# EAGLE board zx80 SD_12 (smd) build006 (STM32) (EAGLE 9.6.2), part 1 of 2
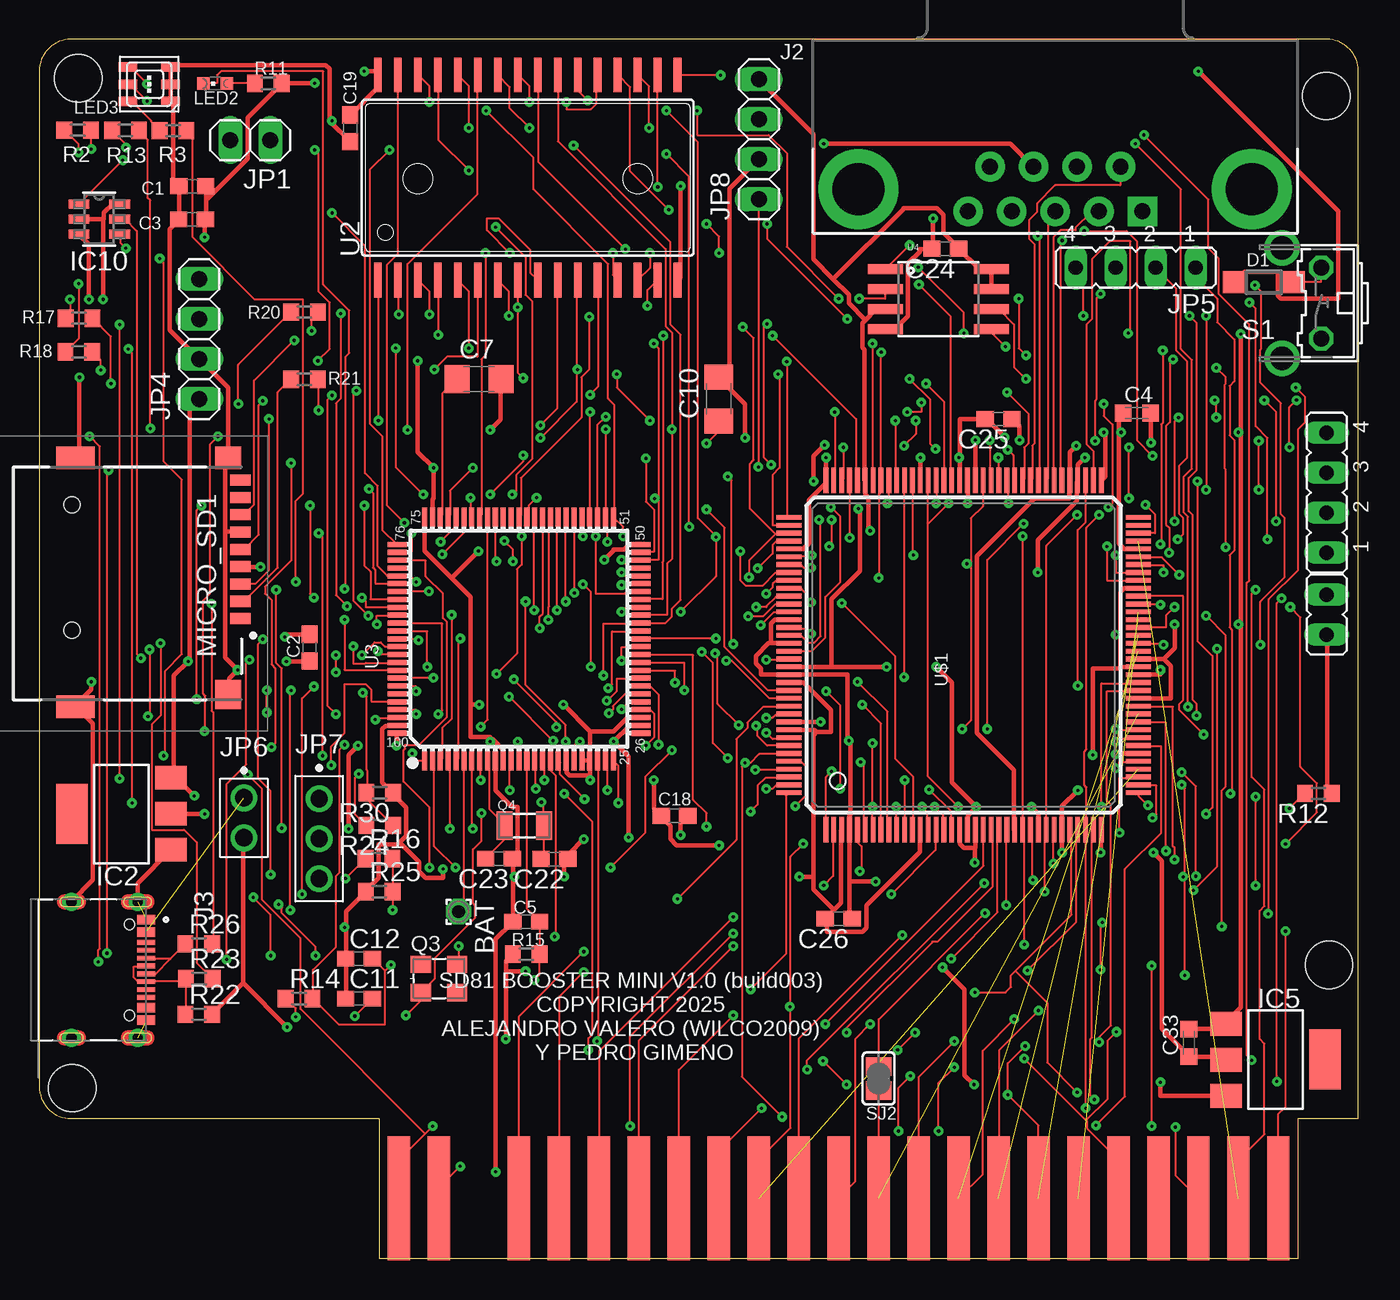
[diagram p3: board, top side]
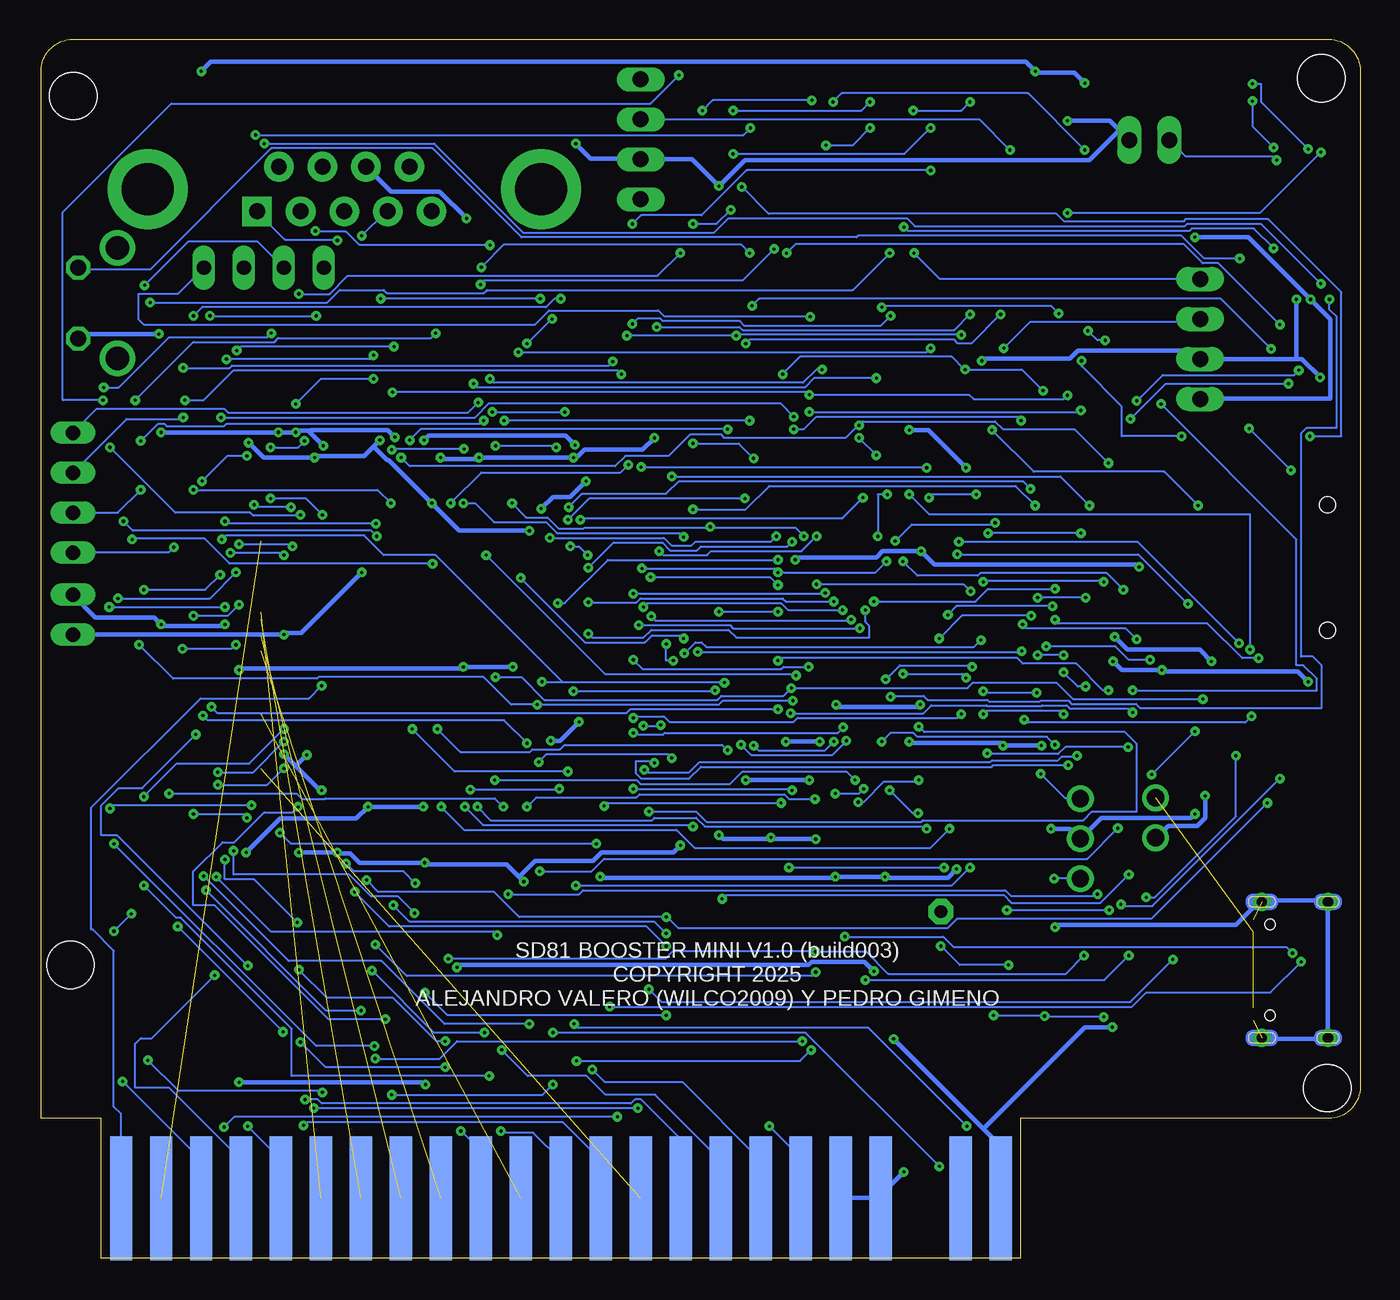
[diagram p4: board, bottom side, seen from below]

Size 83.82 x 77.47 mm. Coordinates in mm from the lower left corner, seen from the top.
Outline: 2,8.89 21.59,8.89 21.59,0 80.01,0 80.01,8.89 83.82,8.89 83.82,75.47 arc90 81.82,77.47 2,77.47 arc90 0,75.47 0,10.89 arc90 2,8.89
Copper layers (1*16): Top 0.035mm / dielectric 1.5mm / Bottom 0.035mm
Design rules "default *": minimum track width 5mil, minimum drill 0.2mm, track to track 6mil, track to pad 6mil, pad to pad 6mil, via to via 6mil, smd to smd 6mil, copper to edge 40mil, drill to drill 6mil, minimum pad ring 10mil, minimum via ring 8mil, stop-mask expansion 4mil, vias tented up to drill 999mil, thermal gap 10mil
Net classes: 1 VCC: width 0.3 mm; 2 3,3: width 0.3 mm
Holes 3 mm at 2.09,10.82 2.46,74.99 81.79,73.87 81.96,18.64

## Footprints (pad centres in the part's own frame; a part is rotated, then mirrored left to right if it is on the bottom)
EDGEPIN = smd 1.422 x 7.874: 1 0,0
1,6/0,8 = drill 0.813 pad 1.6 octagon: 1 0,0
C0603 = smd 1.1 x 1: 1 -0.85,0; 2 0.85,0
C0603K = smd 1.05 x 1.08: 1 -0.875,0; 2 0.875,0
C1206 = smd 1.6 x 1.8: 1 -1.4,0; 2 1.4,0
SOD123 = smd 1.4 x 1.4: A 1.9,0; C -1.9,0
SOT223 = smd 1.499 x 2.007: 1 -2.261,-3.15; 2 0.025,-3.15; 3 2.311,-3.15 | smd 3.81 x 2.007: 4 0,3.15
SOT-23-6_MC = smd 1.321 x 0.559: 1 -1.295,0.95; 2 -1.295,0; 3 -1.295,-0.95; 4 1.295,-0.95; 5 1.295,0; 6 1.295,0.95
DB9_MALE = drill 1.016 pad 1.88 square: 1 5.54,-1.42 | drill 1.016 pad 1.88: 2 2.77,-1.42; 3 0,-1.42; 4 -2.77,-1.42; 5 -5.54,-1.42; 6 4.15,1.42; 7 1.38,1.42; 8 -1.38,1.42; 9 -4.15,1.42 | drill 3.302 pad 5.08: G1 -12.5,0; G2 12.5,0
SHOUHAN_TYPE-C_16PIN_2MD__073_ = smd 0.6 x 1.14: A1_B12 -3.2,3.675; A4_B9 -2.4,3.675; B1_A12 3.2,3.675; B4_A9 2.4,3.675 | smd 0.3 x 1.14: A5 -1.25,3.675; A6 -0.25,3.675; A7 0.25,3.675; A8 1.25,3.675; B5 1.75,3.675; B6 0.75,3.675; B7 -0.75,3.675; B8 -1.75,3.675 | drill 0.65 pad 0.95: SH1 -4.325,3.125; SH2 4.325,3.125; SH3 -4.325,-1.075; SH4 4.325,-1.075 | hole 0.65: -2.89,2.605; 2.89,2.605
1X02 = drill 1.016 long: 1 -1.27,0; 2 1.27,0
JP1 = drill 0.914 long: 1 0,-1.27; 2 0,1.27
JP4 = drill 0.914 long: 1 -3.81,0; 2 -1.27,0; 3 1.27,0; 4 3.81,0
1X04 = drill 1.016 long: 1 -3.81,0; 2 -1.27,0; 3 1.27,0; 4 3.81,0
HDRV2W64P254_2X1_300X350X838B = drill 1.105 pad 1.705: 1 0,0; 2 0,-2.54
HDRV3W64P254_3X1_300X654X838B = drill 1.105 pad 1.705: 1 0,0; 2 0,-2.54; 3 0,-5.08
CHIPLED_0603 = smd 0.8 x 0.8: A 0,-0.75; C 0,0.75
3535-PLCC6 = smd 1.2 x 0.6: P1 1.35,-1.1; P2 1.35,0; P3 1.35,1.1; P4 -1.35,1.1; P5 -1.35,0; P6 -1.35,-1.1
TF-01A = smd 0.7 x 1.3: 1 2.23,7.174; 2 1.13,7.174; 3 0.03,7.174; 4 -1.07,7.174; 5 -2.17,7.174; 6 -3.27,7.174; 7 -4.37,7.174; 8 -5.47,7.174; CD1 -6.57,7.174 | smd 1.448 x 1.651: MP1 -7.989,6.4 | smd 1.448 x 2.438: MP2 -7.989,-3.3; MP3 7.836,-3.3 | smd 1.854 x 1.651: MP4 7.061,6.4 | hole 1: -5.004,-3.531; 2.972,-3.531
3.2X2.5_KX-7 = smd 1.3 x 1.1: 1 -1.15,-0.9; 2 1.15,-0.9; 3 1.15,0.9; 4 -1.15,0.9
3.2X1.5 = smd 1 x 1.8: 1 -1.25,0; 2 1.25,0
R0603 = smd 1 x 1.1: 1 -0.85,0; 2 0.85,0
B3F-31XX = drill 1.016 octagon: 1 -2.261,-1.245; 2 2.261,-1.245 | drill 1.499 pad 2.159: 3 -3.505,1.245; 4 3.505,1.245
SJ = smd 1.168 x 1.6: 1 -0.762,0; 2 0.762,0
SOP32-5 = smd 2.2 x 0.5: 1 -6.516,9.525; 2 -6.516,8.255; 3 -6.516,6.985; 4 -6.516,5.715; 5 -6.516,4.445; 6 -6.516,3.175; 7 -6.516,1.905; 8 -6.516,0.635; 9 -6.516,-0.635; 10 -6.516,-1.905; 11 -6.516,-3.175; 12 -6.516,-4.445; 13 -6.516,-5.715; 14 -6.516,-6.985; 15 -6.516,-8.255; 16 -6.516,-9.525; 17 6.516,-9.525; 18 6.516,-8.255; 19 6.516,-6.985; 20 6.516,-5.715; 21 6.516,-4.445; 22 6.516,-3.175; 23 6.516,-1.905; 24 6.516,-0.635; 25 6.516,0.635; 26 6.516,1.905; 27 6.516,3.175; 28 6.516,4.445; 29 6.516,5.715; 30 6.516,6.985; 31 6.516,8.255; 32 6.516,9.525
LQFP100-0.5-13.8X13.8MM = smd 1.2 x 0.32: 1 -7.75,6; 2 -7.75,5.5; 3 -7.75,5; 4 -7.75,4.5; 5 -7.75,4; 6 -7.75,3.5; 7 -7.75,3; 8 -7.75,2.5; 9 -7.75,2; 10 -7.75,1.5; 11 -7.75,1; 12 -7.75,0.5; 13 -7.75,0; 14 -7.75,-0.5; 15 -7.75,-1; 16 -7.75,-1.5; 17 -7.75,-2; 18 -7.75,-2.5; 19 -7.75,-3; 20 -7.75,-3.5; 21 -7.75,-4; 22 -7.75,-4.5; 23 -7.75,-5; 24 -7.75,-5.5; 25 -7.75,-6; 51 7.75,-6; 52 7.75,-5.5; 53 7.75,-5; 54 7.75,-4.5; 55 7.75,-4; 56 7.75,-3.5; 57 7.75,-3; 58 7.75,-2.5; 59 7.75,-2; 60 7.75,-1.5; 61 7.75,-1; 62 7.75,-0.5; 63 7.75,0; 64 7.75,0.5; 65 7.75,1; 66 7.75,1.5; 67 7.75,2; 68 7.75,2.5; 69 7.75,3; 70 7.75,3.5; 71 7.75,4; 72 7.75,4.5; 73 7.75,5; 74 7.75,5.5; 75 7.75,6 | smd 0.32 x 1.2: 26 -6,-7.75; 27 -5.5,-7.75; 28 -5,-7.75; 29 -4.5,-7.75; 30 -4,-7.75; 31 -3.5,-7.75; 32 -3,-7.75; 33 -2.5,-7.75; 34 -2,-7.75; 35 -1.5,-7.75; 36 -1,-7.75; 37 -0.5,-7.75; 38 0,-7.75; 39 0.5,-7.75; 40 1,-7.75; 41 1.5,-7.75; 42 2,-7.75; 43 2.5,-7.75; 44 3,-7.75; 45 3.5,-7.75; 46 4,-7.75; 47 4.5,-7.75; 48 5,-7.75; 49 5.5,-7.75; 50 6,-7.75; 76 6,7.75; 77 5.5,7.75; 78 5,7.75; 79 4.5,7.75; 80 4,7.75; 81 3.5,7.75; 82 3,7.75; 83 2.5,7.75; 84 2,7.75; 85 1.5,7.75; 86 1,7.75; 87 0.5,7.75; 88 0,7.75; 89 -0.5,7.75; 90 -1,7.75; 91 -1.5,7.75; 92 -2,7.75; 93 -2.5,7.75; 94 -3,7.75; 95 -3.5,7.75; 96 -4,7.75; 97 -4.5,7.75; 98 -5,7.75; 99 -5.5,7.75; 100 -6,7.75
SO08-EIAJ = smd 0.61 x 2.21: 1 -1.905,-3.378; 2 -0.635,-3.378; 3 0.635,-3.378; 4 1.905,-3.378; 5 1.905,3.353; 6 0.635,3.353; 7 -0.635,3.353; 8 -1.905,3.353
TQ144 = smd 1.6 x 0.3: P1 -11.1,8.75; P2 -11.1,8.25; P3 -11.1,7.75; P4 -11.1,7.25; P5 -11.1,6.75; P6 -11.1,6.25; P7 -11.1,5.75; P8 -11.1,5.25; P9 -11.1,4.75; P10 -11.1,4.25; P11 -11.1,3.75; P12 -11.1,3.25; P13 -11.1,2.75; P14 -11.1,2.25; P15 -11.1,1.75; P16 -11.1,1.25; P17 -11.1,0.75; P18 -11.1,0.25; P19 -11.1,-0.25; P20 -11.1,-0.75; P21 -11.1,-1.25; P22 -11.1,-1.75; P23 -11.1,-2.25; P24 -11.1,-2.75; P25 -11.1,-3.25; P26 -11.1,-3.75; P27 -11.1,-4.25; P28 -11.1,-4.75; P29 -11.1,-5.25; P30 -11.1,-5.75; P31 -11.1,-6.25; P32 -11.1,-6.75; P33 -11.1,-7.25; P34 -11.1,-7.75; P35 -11.1,-8.25; P36 -11.1,-8.75; P73 11.1,-8.75; P74 11.1,-8.25; P75 11.1,-7.75; P76 11.1,-7.25; P77 11.1,-6.75; P78 11.1,-6.25; P79 11.1,-5.75; P80 11.1,-5.25; P81 11.1,-4.75; P82 11.1,-4.25; P83 11.1,-3.75; P84 11.1,-3.25; P85 11.1,-2.75; P86 11.1,-2.25; P87 11.1,-1.75; P88 11.1,-1.25; P89 11.1,-0.75; P90 11.1,-0.25; P91 11.1,0.25; P92 11.1,0.75; P93 11.1,1.25; P94 11.1,1.75; P95 11.1,2.25; P96 11.1,2.75; P97 11.1,3.25; P98 11.1,3.75; P99 11.1,4.25; P100 11.1,4.75; P101 11.1,5.25; P102 11.1,5.75; P103 11.1,6.25; P104 11.1,6.75; P105 11.1,7.25; P106 11.1,7.75; P107 11.1,8.25; P108 11.1,8.75 | smd 0.3 x 1.6: P37 -8.75,-11.1; P38 -8.25,-11.1; P39 -7.75,-11.1; P40 -7.25,-11.1; P41 -6.75,-11.1; P42 -6.25,-11.1; P43 -5.75,-11.1; P44 -5.25,-11.1; P45 -4.75,-11.1; P46 -4.25,-11.1; P47 -3.75,-11.1; P48 -3.25,-11.1; P49 -2.75,-11.1; P50 -2.25,-11.1; P51 -1.75,-11.1; P52 -1.25,-11.1; P53 -0.75,-11.1; P54 -0.25,-11.1; P55 0.25,-11.1; P56 0.75,-11.1; P57 1.25,-11.1; P58 1.75,-11.1; P59 2.25,-11.1; P60 2.75,-11.1; P61 3.25,-11.1; P62 3.75,-11.1; P63 4.25,-11.1; P64 4.75,-11.1; P65 5.25,-11.1; P66 5.75,-11.1; P67 6.25,-11.1; P68 6.75,-11.1; P69 7.25,-11.1; P70 7.75,-11.1; P71 8.25,-11.1; P72 8.75,-11.1; P109 8.75,11.1; P110 8.25,11.1; P111 7.75,11.1; P112 7.25,11.1; P113 6.75,11.1; P114 6.25,11.1; P115 5.75,11.1; P116 5.25,11.1; P117 4.75,11.1; P118 4.25,11.1; P119 3.75,11.1; P120 3.25,11.1; P121 2.75,11.1; P122 2.25,11.1; P123 1.75,11.1; P124 1.25,11.1; P125 0.75,11.1; P126 0.25,11.1; P127 -0.25,11.1; P128 -0.75,11.1; P129 -1.25,11.1; P130 -1.75,11.1; P131 -2.25,11.1; P132 -2.75,11.1; P133 -3.25,11.1; P134 -3.75,11.1; P135 -4.25,11.1; P136 -4.75,11.1; P137 -5.25,11.1; P138 -5.75,11.1; P139 -6.25,11.1; P140 -6.75,11.1; P141 -7.25,11.1; P142 -7.75,11.1; P143 -8.25,11.1; P144 -8.75,11.1

## Placement (x,y rotation side)
1A  D7  [EDGEPIN]  22.86,3.81 0 top
1B  VCC  [EDGEPIN]  22.86,3.81 180 bottom
2A  /RAMCS  [EDGEPIN]  25.4,3.81 0 top
2B  9V  [EDGEPIN]  25.4,3.81 180 bottom
4A  D0  [EDGEPIN]  30.48,3.81 0 top
4B  GND  [EDGEPIN]  30.48,3.81 180 bottom
5A  D1  [EDGEPIN]  33.02,3.81 0 top
5B  GND  [EDGEPIN]  33.02,3.81 180 bottom
6A  D2  [EDGEPIN]  35.56,3.81 0 top
6B  /CLOCK  [EDGEPIN]  35.56,3.81 180 bottom
7A  D6  [EDGEPIN]  38.1,3.81 0 top
7B  A0  [EDGEPIN]  38.1,3.81 180 bottom
8A  D5  [EDGEPIN]  40.64,3.81 0 top
8B  A1  [EDGEPIN]  40.64,3.81 180 bottom
9A  D3  [EDGEPIN]  43.18,3.81 0 top
9B  A2  [EDGEPIN]  43.18,3.81 180 bottom
10A  D4  [EDGEPIN]  45.72,3.81 0 top
10B  A3  [EDGEPIN]  45.72,3.81 180 bottom
11A  A6  [EDGEPIN]  48.26,3.81 0 top
11B  A15  [EDGEPIN]  48.26,3.81 180 bottom
12A  /NMI  [EDGEPIN]  50.8,3.81 0 top
12B  A14  [EDGEPIN]  50.8,3.81 180 bottom
13A  /HALT  [EDGEPIN]  53.34,3.81 0 top
13B  A13  [EDGEPIN]  53.34,3.81 180 bottom
14A  /MREQ  [EDGEPIN]  55.88,3.81 0 top
14B  A12  [EDGEPIN]  55.88,3.81 180 bottom
15A  /IORQ  [EDGEPIN]  58.42,3.81 0 top
15B  A11  [EDGEPIN]  58.42,3.81 180 bottom
16A  /RD  [EDGEPIN]  60.96,3.81 0 top
16B  A10  [EDGEPIN]  60.96,3.81 180 bottom
17A  /WR  [EDGEPIN]  63.5,3.81 0 top
17B  A9  [EDGEPIN]  63.5,3.81 180 bottom
18A  /BUSAK  [EDGEPIN]  66.04,3.81 0 top
18B  A8  [EDGEPIN]  66.04,3.81 180 bottom
19A  /WAIT  [EDGEPIN]  68.58,3.81 0 top
19B  A7  [EDGEPIN]  68.58,3.81 180 bottom
20A  /BUSRQ  [EDGEPIN]  71.12,3.81 0 top
20B  A6  [EDGEPIN]  71.12,3.81 180 bottom
21A  /RESET  [EDGEPIN]  73.66,3.81 0 top
21B  A5  [EDGEPIN]  73.66,3.81 180 bottom
22A  /M1  [EDGEPIN]  76.2,3.81 0 top
22B  A4  [EDGEPIN]  76.2,3.81 180 bottom
23A  /RFSH  [EDGEPIN]  78.74,3.81 0 top
23B  /ROMCS  [EDGEPIN]  78.74,3.81 180 bottom
BAT  [1,6/0,8]  26.64,22.03 270 top
C1  100nF  [C0603]  9.72,68.13 180 top
C2  100nF  [C0603]  17.17,38.81 270 top
C3  100nF  [C0603]  9.71,66.02 180 top
C4  100nF  [C0603K]  69.75,53.73 0 top
C5  22pF  [C0603]  30.94,21.39 0 top
C7  10uF  [C1206]  27.94,55.88 0 top
C10  10uF  [C1206]  43.18,54.61 90 top
C11  22pF  [C0603]  20.32,16.51 0 top
C12  22pF  [C0603]  20.32,19.05 0 top
C18  100nF  [C0603]  40.37,28.11 0 top
C19  100nF  [C0603]  19.75,71.81 270 top
C22  22pF  [C0603]  32.73,25.38 180 top
C23  22pF  [C0603]  29.21,25.4 180 top
C24  0.1uF  [C0603]  57.58,64.17 180 top
C25  0.1uF  [C0603]  60.96,53.34 180 top
C26  100nF  [C0603]  50.8,21.59 180 top
C33  10uF  [C0603K]  73.05,13.7 90 top
D1  [SOD123]  77.81,62.03 0 top
IC2  REG1117  [SOT223]  5.23,28.23 90 top
IC5  1.2V  [SOT223]  78.57,12.64 270 top
IC10  MCP4725  [SOT-23-6_MC]  3.81,66.04 0 top
J2  JOYSTICK  [DB9_MALE]  64.57,67.96 0 top
J3  TYPE-C_16PIN_2MD__073_  [SHOUHAN_TYPE-C_16PIN_2MD__073_]  3.12,18.33 270 top
JP1  SOUND  [1X02]  13.41,71.06 180 top
JP2  [JP1]  81.81,40.91 0 top
JP3  JTAG  [JP4]  81.81,48.65 90 top
JP4  SERIAL  [1X04]  10.16,58.42 90 top
JP5  RGB  [JP4]  69.68,62.96 180 top
JP6  PWR_SRC  [HDRV2W64P254_2X1_300X350X838B]  13,29.26 0 top
JP7  BOOT  [HDRV3W64P254_3X1_300X654X838B]  17.78,29.21 0 top
JP8  ST-LINK-V2  [1X04]  45.72,71.12 90 top
LED2  SD  [CHIPLED_0603]  11.18,74.66 90 top
LED3  STATUS  [3535-PLCC6]  6.98,74.62 0 top
MICRO_SD1  TF-01A  [TF-01A]  5.6,42.89 270 top
Q3  8MHz  [3.2X2.5_KX-7]  25.4,17.78 0 top
Q4  32767Hz  [3.2X1.5]  30.82,27.49 0 top
R2  150  [R0603]  2.44,71.69 0 top
R3  68  [R0603]  8.51,71.67 180 top
R11  680  [R0603]  14.56,74.66 180 top
R12  2K  [R0603]  81.29,29.54 180 top
R13  150  [R0603]  5.48,71.67 180 top
R14  1M  [R0603]  16.51,16.51 0 top
R15  [R0603]  30.94,19.34 180 top
R16  510  [R0603]  21.59,25.4 0 top
R17  3k3  [R0603]  2.52,59.75 0 top
R18  3k3  [R0603]  2.52,57.61 0 top
R20  3k3  [R0603]  16.85,60.14 0 top
R21  3k3  [R0603]  16.85,55.86 180 top
R22  1K5  [R0603]  10.14,15.5 0 top
R23  22R  [R0603]  10.16,17.78 0 top
R24  510  [R0603]  21.63,27.51 180 top
R25  10K  [R0603]  21.6,23.3 0 top
R26  22R  [R0603]  10.13,19.98 0 top
R30  10K  [R0603]  21.63,29.59 180 top
S1  RESET  [B3F-31XX]  80.22,60.71 90 top
SJ2  MC45  [SJ]  53.34,11.43 270 top
U2  AS6C4008  [SOP32-5]  31.04,68.68 90 top
U3  MCU-STM32F407VET6(LQFP100)  [LQFP100-0.5-13.8X13.8MM]  30.48,39.37 90 top
U4  FLASH-SPI-25XX  [SO08-EIAJ]  57.15,60.96 270 top
U$1  XC6SLX9-2TQG144C  [TQ144]  58.74,38.34 90 top

## Tracks (layer width: path | path; a pad name or v marks a point on that pad's centre or on a via)
1V2  (via drill 0.2)
  Top 0.3: IC5.2 75.4,12.64 75.4,12.79 73.1,12.79 C33.1 73,12.94 71.35,14.59 71.35,25.24 v70.8,25.79 | v63.05,28.69 63.5,28.24 U$1.P28 | U$1.P19 59,28.14 v59.55,28.69 58,30.24 58,36.59 v57,37.59 | v53.85,37.59 50.35,37.59 | 50.35,37.59 U$1.P128 | v59.5,51.99 U$1.P89 | v49.9,51.69 49.2,50.99 v49.2,49.39 | v52.05,47.64 52.15,47.54 52.15,43.69 50.35,41.89 50.35,37.59 | v71.25,37.39 71.25,37.09 U$1.P52
  Bottom 0.3: v59.55,28.69 v63.05,28.69 63.8,27.94 68.65,27.94 v70.8,25.79 | v53.85,37.59 v57,37.59 57.1,37.49 71.15,37.49 v71.25,37.39 | v59.5,51.99 59.2,52.29 50.5,52.29 v49.9,51.69 | v49.2,49.39 50.2,48.39 51.3,48.39 v52.05,47.64
3V3  (via drill 0.2)
  Top 0.3: v70.65,51.84 70.65,53.69 C4.2 | v66.45,50.89 66,50.44 U$1.P76 65.95,49.29 65.95,48.14 63.45,45.64 v63.45,43.59 | v62.3,51.99 62.3,52.89 61.85,53.34 C25.1 | v59,47.99 59,49.39 U$1.P90 | U4.7 60.5,61.64 60.5,62.74 U4.8 60.5,62.89 59.7,62.89 58.45,64.14 C24.1 58.35,64.29 57.45,65.19 57.45,66.34 57.05,66.74 54.9,66.74 54.9,66.69 50.45,62.24 | 52.5,59.64 53.15,60.29 53.75,60.29 U4.3 | 52.5,59.64 52.3,59.44 52.3,57.89 52.45,57.74 52.45,49.44 U$1.P103 52.5,49.29 52.5,48.54 52.7,48.34 52.7,46.34 v52.8,46.24 | 50.45,62.24 51.45,61.24 51.45,60.69 52.5,59.64 | 50.45,62.24 49.2,63.49 49.2,71.44 45.75,74.89 JP8.4 | v10.5,28.24 8.4,28.24 IC2.2 | v39.05,30.39 39.05,28.59 39.5,28.14 C18.1 39.6,27.99 40.1,27.49 40.1,26.64 40.5,26.24 v43.2,26.24 | U3.22 35,31.59 v35,30.39 34.9,30.69 33.7,30.69 33.5,30.89 33.5,31.59 U3.19 | U3.21 34.5,31.64 34.85,31.64 U3.22 | 35,33.49 36.5,33.49 37.35,34.34 38.2,34.34 U3.28 | 35,33.49 35,31.74 U3.22 | 28.8,32.99 28.65,33.14 27.4,33.14 27.4,35.19 | 28.8,32.99 29.5,32.29 29.5,31.64 U3.11 | 27.4,35.19 27.4,42.04 26.2,43.24 | 26.2,43.24 24.5,44.94 24.5,47.09 U3.75 | v22.7,32.59 22.7,33.34 U3.100 | v28.65,32.84 28.8,32.99 | v35.9,44.39 36.5,44.99 36.5,45.04 37.15,45.04 37.45,45.34 38.2,45.34 U3.50 | 26.2,43.24 v27.9,44.94 | v14.05,43.94 12.8,43.94 MICRO_SD1.4 | v33.3,35.19 35,33.49 | 27.4,35.19 v27.95,35.19 | v19.65,27.29 19.65,31.99 v20.25,32.59 | 46.5,39.09 47.6,39.09 U$1.P125 | 46.5,39.09 46.35,39.09 45.55,38.29 45.55,37.79 45.85,37.49 45.85,37.09 47.6,37.09 U$1.P129 47.75,37.09 51.35,37.09 51.35,32.99 v51.45,32.89 51.55,32.79 51.55,28.19 51.5,28.14 51.5,27.39 U$1.P4 51.5,27.19 51.5,23.94
  Top 0.3: 46.5,39.09 46.5,40.34 46.75,40.59 47.6,40.59 U$1.P122 | C26.1 51.5,21.74 51.5,23.94 | v49.65,34.09 U$1.P135 | R12.1 82.1,29.59 81.85,29.84 81.85,39.59 JP2.1 | 68.7,37.59 69.8,37.59 U$1.P53 | 68.7,39.64 68.7,42.34 68.95,42.59 69.8,42.59 U$1.P63 | 68.7,39.64 68.7,37.59 | 59.45,26.09 59.5,26.09 59.5,27.19 U$1.P20 | 59.45,26.09 58.75,26.09 58.5,26.34 58.5,27.19 U$1.P18 | v65,25.79 65,27.19 U$1.P31 65,27.39 65,28.74 v66,29.74 | v67.45,25.79 67.45,27.19 U$1.P36 | v68.4,32.04 68.4,32.09 69.8,32.09 U$1.P42 | v59.45,25.14 59.45,26.09 | v66.95,31.99 66.95,37.49 68.6,37.49 68.7,37.59 | 68.7,39.64 v68.4,39.64 | v53.15,23.94 51.5,23.94
  Bottom 0.3: v70.65,51.84 69.7,50.89 v66.45,50.89 66.35,50.99 63.3,50.99 62.7,51.59 | 62.7,51.59 v62.3,51.99 | 62.7,51.59 61.85,50.74 61.75,50.74 v59,47.99 57.25,46.24 v52.8,46.24 | v10.5,28.24 10.75,27.99 16.45,27.99 17.75,26.69 JP7.2 17.9,26.74 18.45,27.29 v19.65,27.29 | v35,30.39 v39.05,30.39 | v28.65,32.84 28.55,32.74 22.85,32.74 v22.7,32.59 v20.25,32.59 | v35.9,44.39 35.75,44.54 30.75,44.54 30.35,44.94 v27.9,44.94 27.05,44.09 14.2,44.09 v14.05,43.94 | v33.3,35.19 33.15,35.04 28.1,35.04 v27.95,35.19 | v49.65,34.09 50.85,32.89 v51.45,32.89 | v67.45,25.79 v65,25.79 64.9,25.74 64.2,25.74 63.6,25.14 v59.45,25.14 59.35,25.04 54.25,25.04 53.45,24.24 | 67.65,31.29 66.1,29.74 v66,29.74 | 67.65,31.29 v68.4,32.04 | 67.65,31.29 v66.95,31.99 | JP2.1 v68.4,39.64 68.3,39.74 67.3,39.74 v63.45,43.59 | 53.45,24.24 v53.15,23.94 | v43.2,26.24 43.65,25.79 48.2,25.79 48.75,25.24 52.45,25.24 53.45,24.24
/CLOCK  (via drill 0.2)
  Top 0.127: v61.45,22.44 61.45,27.19 U$1.P24 | v44.1,20.64 37.55,14.09 v37.55,8.39
  Bottom 0.127: v61.45,22.44 60.4,21.39 44.85,21.39 v44.1,20.64 | v37.55,8.39 35.6,6.44 35.6,3.84 6B.1
/HALT
  Top 0.127: SJ2.2 53.35,10.64 53.35,3.84 13A.1
/IORQ  (via drill 0.2)
  Top 0.127: v67.5,28.69 67.5,36.54 69.8,36.54 U$1.P51 | v61.95,15.19 59.95,13.19 59.95,5.34 15A.1
  Bottom 0.127: v67.5,28.69 67.85,28.34 69.65,28.34 71.55,26.44 72.3,26.44 74.15,24.59 74.15,22.44 72.8,22.44 65.55,15.19 v61.95,15.19
/M1  (via drill 0.2)
  Top 0.127: v72.45,43.44 71.35,44.54 69.85,44.54 U$1.P67 | v77.3,42.49 77.05,42.24 77.05,30.59 77.85,29.79 77.85,22.39 77.55,22.09 77.55,13.94 77.85,13.64 77.85,7.89 76.2,6.24 22A.1
  Bottom 0.127: v72.45,43.44 73.4,42.49 v77.3,42.49
/MEM_CE  (via drill 0.2)
  Top 0.127: v61.6,47.99 61.6,49.29 61.5,49.39 U$1.P85 | v74.15,59.89 v74.15,48.84 | v50.8,60.99 47.5,64.29 47.5,70.24 46.35,71.39 41.8,71.39 v41.8,72.94 | v34.85,73.59 34.25,74.19 34.25,75.19 U2.22
  Bottom 0.127: v61.6,47.99 62.45,48.84 v74.15,48.84 | v74.15,59.89 73.6,60.44 51.75,60.44 51.2,60.99 v50.8,60.99 | v41.8,72.94 41.15,73.59 v34.85,73.59
/MEM_OE  (via drill 0.2)
  Top 0.127: v55.9,61.89 57.9,59.89 57.9,49.49 57.95,49.44 U$1.P92 | v37.25,64.14 31.7,69.69 31.7,75.19 U2.24
  Bottom 0.127: v55.9,61.89 55.65,62.14 39.25,62.14 v37.25,64.14
/MREQ  (via drill 0.2)
  Top 0.127: v72.15,25.34 72.15,26.09 72.05,26.19 72.05,35.04 69.85,35.04 U$1.P48 | v67.55,21.34 67.45,21.24 v67.45,18.34 | v58.15,13.79 55.9,11.54 55.9,3.84 14A.1
  Bottom 0.127: v72.15,25.34 72.15,24.09 70.3,24.09 v67.55,21.34 | v67.45,18.34 65.65,16.54 61.45,16.54 58.7,13.79 v58.15,13.79
/NMI  (via drill 0.2)
  Top 0.127: v68.4,32.84 68.4,33.04 69.8,33.04 U$1.P44 | v72.6,30.89 73.5,29.99 v73.5,24.29 | v52.8,14.89 51.85,13.94 51.85,4.89 50.8,3.84 12A.1
  Bottom 0.127: v68.4,32.84 70.35,30.89 v72.6,30.89 | v73.5,24.29 68.1,18.89 62.2,18.89 58.2,14.89 v52.8,14.89
/OE_OL  (via drill 0.2)
  Top 0.127: v37,44.39 37.45,43.94 37.45,43.89 38.2,43.89 U3.47 | v51,41.64 54.4,38.24 54.4,31.74 55.55,30.59 55.55,27.29 U$1.P12
  Bottom 0.127: v37,44.39 47.8,44.39 50.55,41.64 v51,41.64
/RAMCS  (via drill 0.2)
  Top 0.127: v51.3,14.34 51.3,14.64 56.75,20.09 56.75,20.14 57.1,20.14 60.6,23.64 60.6,27.09 60.5,27.19 U$1.P22 | v26.75,5.84 25.4,4.49 2A.1
  Bottom 0.127: v51.3,14.34 35.25,14.34 v26.75,5.84
/RD  (via drill 0.2)
  Top 0.127: v71.45,38.99 71.45,39.04 69.85,39.04 U$1.P56 | v74.85,38.74 74.85,24.89 v73.35,23.39 | v63.5,15.74 61,13.24 61,3.84 16A.1
  Bottom 0.127: v71.45,38.99 71.7,38.74 v74.85,38.74 | v73.35,23.39 65.7,15.74 v63.5,15.74
/RESET  (via drill 0.2)
  Top 0.127: v18.55,31.34 18.55,32.54 19.4,33.39 19.4,36.49 20.75,36.49 21.1,36.14 21.1,35.39 22.7,35.39 U3.96 | U$1.P139 47.6,32.04 45.75,32.04 45.2,31.49 v44.85,31.49 44.85,31.44 44.65,31.24 44.65,11.54 v47.2,8.99 | v72.2,8.34 72.2,5.29 73.65,3.84 21A.1
  Bottom 0.127: v18.55,31.34 23.3,31.34 23.4,31.24 41.9,31.24 42.65,30.49 45.7,30.49 46.05,30.84 46.05,31.59 44.95,31.59 v44.85,31.49 | v72.2,8.34 71.55,8.99 v47.2,8.99
/RFSH  (via drill 0.2)
  Top 0.127: v69.2,58.79 69.35,58.94 69.35,64.64 68.05,64.64 66.9,63.49 66.9,59.69 66.55,59.34 66.55,51.74 67,51.29 U$1.P74 | v79.85,55.34 80.45,54.74 80.45,53.14 80,52.69 80,43.74 78.15,41.89 78.15,21.94 v78.1,21.89 | v79.2,20.79 79.2,9.64 78.75,9.19 78.75,3.84 23A.1
  Bottom 0.127: v69.2,58.79 69.45,58.54 75.7,58.54 78.9,55.34 v79.85,55.34 | v79.2,20.79 v78.1,21.89
/ROMCS  (via drill 0.2)
  Top 0.127: v66,36.39 66,46.29 66.5,46.79 66.5,49.39 U$1.P75
  Bottom 0.127: v66,36.39 66.8,35.59 73.7,35.59 80.65,28.64 80.65,20.89 80.55,20.89 79.2,19.54 79.2,9.64 78.75,9.19 78.75,3.84 23B.1
/WAIT  (via drill 0.2)
  Top 0.127: v35.45,13.79 35.55,13.89 35.55,31.54 35.5,31.59 U3.23 | 66.53,8.77 66.6,8.69 66.6,8.24 68.55,6.29 68.55,3.84 19A.1 | 66.53,8.77 v62.6,12.69 | v71.25,41.54 69.85,41.54 U$1.P61 | v74.15,40.84 75.4,39.59 75.4,29.99 75.15,29.74 v75.15,21.09 | v68.45,14.39 67.9,13.84 67.9,10.14 66.53,8.77
  Bottom 0.127: v35.45,13.79 57.4,13.79 58.5,12.69 v62.6,12.69 | v71.25,41.54 71.95,40.84 v74.15,40.84 | v68.45,14.39 v75.15,21.09
/WR  (via drill 0.2)
  Top 0.127: v31.55,29.84 31.55,31.54 31.5,31.59 U3.15 | v33.35,29.54 35.15,27.74 35.15,14.24 34.9,13.99 v34.9,13.24 | v51.3,11.04 v49.8,12.54 | 17A.1 63.5,8.44 v61.55,10.39 61.55,12.39 v62.65,13.49 | v72.15,41.39 71.6,40.84 71.6,40.09 U$1.P58 | v79.5,41.39 80.15,40.74 80.15,31.24 81.2,30.19 81.2,28.34 v79.2,26.34
  Bottom 0.127: v31.55,29.84 31.85,29.54 v33.35,29.54 | v34.9,13.24 35.6,12.54 v49.8,12.54 | v51.3,11.04 51.95,10.39 v61.55,10.39 | v79.5,41.39 v72.15,41.39 | v79.2,26.34 66.35,13.49 v62.65,13.49
/WR'  (via drill 0.2)
  Top 0.127: v52.95,58.14 52.95,49.44 U$1.P102 | v51.35,59.69 46.25,64.79 v46.25,65.74 | v27.3,69.14 25.35,71.09 25.35,75.19 U2.29
  Bottom 0.127: v52.95,58.14 51.4,59.69 v51.35,59.69 | v46.25,65.74 45.7,66.29 41.85,66.29 39,69.14 v27.3,69.14
A0  (via drill 0.2)
  Top 0.127: v64.45,25.09 64.45,27.19 U$1.P30 | v60.05,23.84 48.8,12.59 v48.8,11.99
  Bottom 0.127: v64.45,25.09 63.95,24.59 60.8,24.59 v60.05,23.84 | v48.8,11.99 48,11.19 43.05,11.19 38.1,6.24 7B.1
A0'  (via drill 0.2)
  Top 0.127: v23.95,34.59 23.95,34.84 22.75,34.84 U3.97 | v18.85,34.59 18.3,35.14 18.3,54.54 v18.6,54.84 | v35,54.89 35.5,55.39 35.5,62.14 U2.12 | v61.5,55.04 62.85,53.69 62.85,51.79 62.6,51.54 62.6,49.54 U$1.P83
  Bottom 0.127: v23.95,34.59 23.75,34.79 19.05,34.79 v18.85,34.59 | v18.6,54.84 18.85,54.59 24.55,54.59 24.85,54.89 v35,54.89 35.05,54.89 35.2,55.04 v61.5,55.04
A1  (via drill 0.2)
  Top 0.127: v62.8,18.29 65.9,21.39 65.9,27.14 65.95,27.19 U$1.P33 | v54.55,13.24 v55.65,14.34
  Bottom 0.127: v62.8,18.29 58.85,14.34 v55.65,14.34 | v54.55,13.24 52.9,11.59 49.15,11.59 47.95,10.39 44.8,10.39 40.65,6.24 40.65,3.84 8B.1
A1'  (via drill 0.2)
  Top 0.127: v21.35,34.24 21.35,34.34 22.7,34.34 U3.98 | v6.9,34.44 7,34.54 v7,38.69 | v28.65,48.54 30.75,50.64 v30.75,51.04 | v31.85,52.14 34.15,54.44 34.15,56.49 | 34.15,56.49 34.15,62.09 34.2,62.14 U2.11 | v61.55,51.39 61.9,51.04 61.9,49.49 61.95,49.44 U$1.P84 | v56.95,51.44 56.6,51.79 56.6,54.59 v55.3,55.89 | v34.2,56.49 34.15,56.49
  Bottom 0.127: v21.35,34.24 21.15,34.04 7.3,34.04 v6.9,34.44 | v7,38.69 7,47.29 27.4,47.29 v28.65,48.54 | v31.85,52.14 v30.75,51.04 | v61.55,51.39 61.5,51.44 v56.95,51.44 | v55.3,55.89 55.05,55.64 35.4,55.64 34.55,56.49 v34.2,56.49
A2  (via drill 0.2)
  Top 0.127: v67.05,10.09 66.8,10.34 66.8,13.94 66.9,14.04 66.9,27.14 66.95,27.19 U$1.P35
  Bottom 0.127: v67.05,10.09 66.25,10.09 66,9.84 46.35,9.84 46.1,10.09 45.7,10.09 43.2,7.59 43.2,3.84 9B.1
A2'  (via drill 0.2)
  Top 0.127: v23.7,32.09 23.7,31.64 24.45,31.64 U3.1 | v14.75,32.49 15,32.74 15,37.49 14.75,37.74 14.75,41.84 14.35,42.24 14.35,42.69 16,44.34 v16,50.54 | v31.85,52.94 32.9,53.99 32.9,62.14 U2.10 | v60.95,50.89 60.95,49.44 U$1.P86
  Bottom 0.127: v23.7,32.09 23.65,32.04 19.2,32.04 18.75,32.49 v14.75,32.49 | v16,50.54 18.15,52.69 22.7,52.69 23.2,53.19 31.6,53.19 v31.85,52.94 31.9,52.94 32.7,52.14 40.4,52.14 40.6,52.34 42.6,52.34 43.95,50.99 46.7,50.99 47.35,50.34 60.4,50.34 v60.95,50.89
A3  (1 unrouted)
A3'  (via drill 0.2)
  Top 0.127: v26.45,24.84 25.1,26.19 25.1,31.49 25,31.59 U3.2 | v36.3,24.84 38.5,27.04 38.5,30.59 v40.2,32.29 | v58.65,33.64 59.2,34.19 59.2,44.14 | 59.2,44.14 59.2,47.04 59.95,47.79 59.95,49.39 U$1.P88 | v29.9,63.89 28.45,65.34 28.45,66.09 29.2,66.09 31.2,64.09 31.2,62.64 31.65,62.19 U2.9 | v76.9,60.74 77.3,60.34 77.3,52.89 78.05,52.14 v78.05,45.69 | 59.2,44.14 v58.95,44.14
  Bottom 0.127: v36.3,24.84 v26.45,24.84 | v40.2,32.29 40.55,32.64 50.55,32.64 50.85,32.34 52.6,32.34 52.75,32.19 57.2,32.19 v58.65,33.64 | v29.9,63.89 32.25,61.54 55.5,61.54 55.7,61.34 61.85,61.34 62.05,61.54 64.85,61.54 65.65,60.74 v76.9,60.74 | v78.05,45.69 78,45.74 73.45,45.74 71.85,44.14 v58.95,44.14
A4  (1 unrouted)
A4'  (via drill 0.2)
  Top 0.127: U3.3 25.6,31.74 25.6,33.69 26.2,34.29 v26.2,40.89 | v19.55,41.44 18.85,42.14 18.85,54.34 19.15,54.64 v19.15,60.04 | U2.8 30.4,62.14 v30.4,60.44 30.4,56.29 v30.75,55.94 | v56.35,55.59 57.5,54.44 U$1.P93
  Bottom 0.127: v26.2,40.89 25.65,41.44 v19.55,41.44 | v19.15,60.04 19.65,60.54 30.3,60.54 v30.4,60.44 | v56.35,55.59 56.1,55.34 35.3,55.34 34.7,55.94 v30.75,55.94
A5  (via drill 0.2)
  Top 0.127: v71.45,43.59 71.45,44.04 69.85,44.04 U$1.P66 | v78.95,41.94 78.65,41.64 v78.65,11.24
  Bottom 0.127: v71.45,43.59 73.1,41.94 v78.95,41.94 | v78.65,11.24 73.7,6.29 73.7,3.84 21B.1
A5'  (via drill 0.2)
  Top 0.127: v26.1,27.29 26.1,31.49 26,31.59 U3.4 | v58.4,28.69 56.45,30.64 56.45,46.69 | 56.45,46.69 56.45,49.39 U$1.P95 | v29.85,59.89 29.85,61.44 29.15,62.14 U2.7 | v46.25,59.39 46.05,59.19 46.05,50.89 v46.5,50.44 | v57.8,47.99 56.5,46.69 56.45,46.69
  Bottom 0.127: v26.1,27.29 27.3,26.09 42.3,26.09 43.45,27.24 56.95,27.24 v58.4,28.69 | v29.85,59.89 30.45,59.29 39.15,59.29 39.45,59.59 44.35,59.59 44.5,59.74 45.9,59.74 v46.25,59.39 | v46.5,50.44 47,49.94 55.85,49.94 v57.8,47.99
A6  (via drill 0.2)
  Top 0.127: v68.4,31.14 68.65,31.39 68.65,31.54 69.8,31.54 U$1.P41 | v72.6,30.09 72.8,29.89 72.8,24.24 | v72.8,17.99 72.8,24.24 | v54.85,20.54 48.25,13.94 48.25,3.84 11A.1 | v72.7,24.24 72.8,24.24
  Bottom 0.127: v68.4,31.14 69.45,30.09 v72.6,30.09 | v72.8,17.99 76.8,13.99 77.5,13.99 77.85,13.64 77.85,10.84 75.7,10.84 71.15,6.29 71.15,3.84 20B.1 | v54.85,20.54 55.1,20.79 69.25,20.79 v72.7,24.24
A6'  (via drill 0.2)
  Top 0.127: U3.5 26.6,31.74 26.6,39.24 v26.75,39.39 | v20.9,40.84 19.95,41.79 19.95,54.94 v20.15,55.14 | v25.1,56.49 25.9,57.29 27.85,57.29 27.85,62.14 U2.6 | v54.4,53.24 54.4,49.49 54.45,49.44 U$1.P99 | v38.8,53.24 36.7,55.34 v36.7,56.19
  Bottom 0.127: v26.75,39.39 25.3,40.84 v20.9,40.84 | v20.15,55.14 21.5,56.49 v25.1,56.49 25.15,56.49 25.95,57.29 35.6,57.29 v36.7,56.19 | v38.8,53.24 v54.4,53.24
A7  (via drill 0.2)
  Top 0.127: v74,33.29 72.45,34.84 72.45,35.24 72.7,35.49 72.7,42.09 U$1.P62 | v70.7,8.39 v70.7,18.59
  Bottom 0.127: v74,33.29 77.4,29.89 78.9,29.89 80,28.79 80,26.89 79,26.89 v70.7,18.59 | v70.7,8.39 68.6,6.29 68.6,3.84 19B.1
A7'  (via drill 0.2)
  Top 0.127: v43,39.39 38.25,39.39 U3.38 | v53.35,43.24 53.35,48.54 53.45,48.64 53.45,49.39 U$1.P101 53.5,49.49 v53.5,57.59 | v27.3,57.84 27.3,61.44 26.6,62.14 U2.5
  Bottom 0.127: v43,39.39 43.2,39.59 45,39.59 45.45,39.14 49.25,39.14 v53.35,43.24 | v27.3,57.84 27.55,57.59 v53.5,57.59
A8  (1 unrouted)
A8'  (via drill 0.2)
  Top 0.127: v36.15,36.24 36.4,36.49 36.4,39.84 38.2,39.84 U3.39 | v54.95,36.94 54.95,49.39 U$1.P98 | v23.4,52.64 23.4,63.19 27.85,67.64 27.85,75.19 U2.27 | v10.3,47.84 10,47.54 v10,35.54
  Bottom 0.127: v54.95,36.94 53.3,36.94 51.85,35.49 40.85,35.49 40.6,35.74 36.65,35.74 v36.15,36.24 24.95,36.24 24.6,36.59 19.3,36.59 18.25,35.54 v10,35.54 | v23.4,52.64 20.75,49.99 12.45,49.99 v10.3,47.84
A9  (1 unrouted)
A9'  (via drill 0.2)
  Top 0.127: v35.85,37.04 35.85,40.34 38.2,40.34 U3.40 38.25,40.39 39.8,40.39 40.2,40.79 40.2,41.29 40.75,41.84 40.75,58.69 40.1,59.34 40.1,64.59 v33.95,70.74 | v55.55,44.69 55.5,44.74 55.5,49.39 U$1.P97 | v31.15,71.84 29.9,73.09 29.9,74.44 U2.26
  Bottom 0.127: v35.85,37.04 35.95,37.14 48,37.14 v55.55,44.69 | v31.15,71.84 32.25,70.74 v33.95,70.74
A10  (1 unrouted)
A10'  (via drill 0.2)
  Top 0.127: U3.41 38.25,40.89 39.9,40.89 39.9,44.14 40.2,44.44 v40.2,52.69 40.2,58.84 39.8,59.24 39.8,64.14 32.95,70.99 U2.23 | v60.4,51.99 60.4,49.49 60.45,49.44 U$1.P87
  Bottom 0.127: v60.4,51.99 59.7,52.69 v40.2,52.69
A11  (1 unrouted)
A11'  (via drill 0.2)
  Top 0.127: v37,41.09 37,41.34 38.2,41.34 U3.42 | v40.75,41.09 43,43.34 v43,45.84 43,45.89 41.85,47.04 41.85,70.94 v39.85,72.94 | v57,47.99 57,49.39 U$1.P94 | v31.15,73.49 31.15,74.49 30.45,75.19 U2.25
  Bottom 0.127: v40.75,41.09 v37,41.09 | v43,45.84 43.25,46.09 51.05,46.09 51.75,46.79 55.05,46.79 56.25,47.99 v57,47.99 | v31.15,73.49 31.7,72.94 v39.85,72.94
A12  (via drill 0.2)
  Top 0.127: v67.35,13.74 67.35,14.04 68.1,14.79 68.1,28.84 67.85,29.09 67.85,36.04 69.8,36.04 U$1.P50 | v58.15,12.14 57.15,11.14 v57.15,8.09
  Bottom 0.127: v67.35,13.74 65.75,12.14 v58.15,12.14 | v57.15,8.09 55.9,6.84 55.9,3.84 14B.1
A12'  (via drill 0.2)
  Top 0.127: v39.65,58.64 39.65,44.29 39.6,44.24 39.6,41.89 38.25,41.89 U3.43 | v25.35,58.69 25.35,62.14 U2.4 | v46.6,58.64 51.9,53.34 51.9,49.49 51.95,49.44 U$1.P104
  Bottom 0.127: v25.35,58.69 39.6,58.69 v39.65,58.64 v46.6,58.64
A13  (1 unrouted)
A13'  (via drill 0.2)
  Top 0.127: v35.35,45.89 35.35,42.24 37.2,42.24 37.3,42.34 38.2,42.34 U3.44 | v53.9,47.99 53.95,48.04 53.95,49.39 U$1.P100 | v27.3,71.84 27.3,74.49 U2.28 | v39.85,70.19 41.3,68.74 v41.3,46.49
  Bottom 0.127: v35.35,45.89 35.9,46.44 41.3,46.44 | 41.3,46.44 49.3,46.44 49.35,46.39 50.95,46.39 51.65,47.09 53,47.09 v53.9,47.99 | v27.3,71.84 28.95,70.19 v39.85,70.19 | v41.3,46.49 41.3,46.44
A14  (via drill 0.2)
  Top 0.127: v68.4,33.64 68.4,33.59 69.8,33.59 U$1.P45 | v77.3,23.69 v77.3,29.34 | v55.35,11.59 54.6,10.84 v54.6,8.09
  Bottom 0.127: v68.4,33.64 70.6,31.44 75.2,31.44 v77.3,29.34 | v77.3,23.69 75.25,21.64 74.95,21.64 67.9,14.59 67.9,11.59 v55.35,11.59 | v54.6,8.09 54.5,7.99 52.55,7.99 50.8,6.24 12B.1
A14'  (via drill 0.2)
  Top 0.127: v37,42.79 37,42.84 38.2,42.84 U3.45 | v45.1,43.29 45.1,44.34 46.78,46.02 | 46.78,46.02 46.8,46.04 47.6,46.04 U$1.P111 | v24.8,59.99 24.8,61.44 24.1,62.14 U2.3 | v44.7,59.19 45.4,58.49 45.4,50.74 45.15,50.49 45.15,47.64 46.78,46.02
  Bottom 0.127: v37,42.79 37.5,43.29 v45.1,43.29 | v24.8,59.99 25.8,58.99 39.25,58.99 39.45,59.19 v44.7,59.19
A15  (via drill 0.2)
  Top 0.127: v67.15,8.44 69,10.29 69,24.74 71.3,27.04 71.3,32.54 69.85,32.54 U$1.P43
  Bottom 0.127: v67.15,8.44 66.95,8.64 50.65,8.64 48.3,6.29 48.3,3.84 11B.1
A15'  (via drill 0.2)
  Top 0.127: v37,43.59 37,43.39 38.2,43.39 U3.46 | v45.65,43.84 46.6,44.79 46.6,45.34 46.8,45.54 47.6,45.54 U$1.P112 | v23.2,46.74 22.1,47.84 22.1,63.14 22.8,63.84 U2.31 | v29.55,45.59 30.1,45.04 v30.1,44.29
  Bottom 0.127: v45.65,43.84 37.25,43.84 v37,43.59 30.8,43.59 v30.1,44.29 | v23.2,46.74 23.3,46.64 28.5,46.64 v29.55,45.59
A16'  (via drill 0.2)
  Top 0.127: 39.35,48.29 39.35,57.84 v39.05,58.14 | 39.35,48.29 39.35,44.39 38.25,44.39 U3.48 | v22.85,59.99 22.8,60.04 22.8,62.14 U2.2 | v49.1,44.69 49.1,44.59 U$1.P114 | v50.2,45.24 50.35,45.39 v50.35,46.94 | 39.35,48.29 v39.1,48.29
  Bottom 0.127: v39.05,58.14 38.8,58.39 25.8,58.39 25.55,58.14 24.7,58.14 v22.85,59.99 | v49.1,44.69 49.65,45.24 v50.2,45.24 | v50.35,46.94 49,48.29 v39.1,48.29
A17'  (via drill 0.2)
  Top 0.127: v37.1,45.89 37.1,46.49 36.5,47.09 U3.51 36.55,47.09 36.55,54.24 36.15,54.64 36.15,63.19 31.4,67.94 31.4,69.94 v28.4,72.94 | v51.5,45.79 51.5,49.39 U$1.P105 | v24.8,73.49 24.8,74.49 24.1,75.19 U2.30
  Bottom 0.127: v37.1,45.89 37.45,45.54 42.25,45.54 42.5,45.29 43.75,45.29 44.25,45.79 v51.5,45.79 | v24.8,73.49 25.35,72.94 v28.4,72.94
A18'  (via drill 0.2)
  Top 0.127: v36.1,45.54 36.1,46.99 36,47.09 U3.52 36,47.14 v36,52.69 | v49.05,43.89 48.6,43.89 48.45,44.04 47.65,44.04 U$1.P115 | v21.55,53.24 21.55,62.14 U2.1
  Bottom 0.127: v36.1,45.54 36.4,45.24 41.9,45.24 42.15,44.99 43.85,44.99 44.35,45.49 47.45,45.49 v49.05,43.89 | v21.55,53.24 21.8,53.49 34.55,53.49 35.35,52.69 v36,52.69
B0  (via drill 0.2)
  Top 0.127: v34.55,45.89 34.55,47.04 34.5,47.09 U3.55 | v44.55,44.94 44.55,43.09 44.9,42.74 45.95,42.74 46.75,43.54 47.6,43.54 U$1.P116
  Bottom 0.127: v34.55,45.89 35.5,44.94 41.25,44.94 41.5,44.69 44.3,44.69 v44.55,44.94
B1  (via drill 0.2)
  Top 0.127: v34,42.29 34,47.09 U3.56 | v46.2,42.24 46.6,42.64 46.6,42.84 46.8,43.04 47.6,43.04 U$1.P117
  Bottom 0.127: v34,42.29 34.05,42.24 v46.2,42.24
B2  (via drill 0.2)
  Top 0.127: v33.45,41.74 33.45,47.09 U3.57 | v49.05,41.69 48.7,42.04 48.7,42.29 48.45,42.54 47.65,42.54 U$1.P118
  Bottom 0.127: v33.45,41.74 36.5,41.74 36.7,41.94 45.75,41.94 46,41.69 v49.05,41.69
B3  (via drill 0.2)
  Top 0.127: U3.58 32.9,47.04 v32.9,41.19 | v45.55,41.39 46.2,41.39 46.2,41.44 46.8,42.04 47.6,42.04 U$1.P119
  Bottom 0.127: v32.9,41.19 36.35,41.19 36.8,41.64 45.3,41.64 v45.55,41.39
B4  (via drill 0.2)
  Top 0.127: U3.59 32.4,47.04 32.4,41.44 32.35,41.39 v32.35,40.59 | v45.05,40.79 46,40.79 46.75,41.54 47.6,41.54 U$1.P120
  Bottom 0.127: v32.35,40.59 32.4,40.54 44.8,40.54 v45.05,40.79
B5  (via drill 0.2)
  Top 0.127: v31.8,40.04 31.8,40.79 32,40.99 32,47.09 U3.60 | v45.85,40.24 46.65,41.04 47.6,41.04 U$1.P121
  Bottom 0.127: v31.8,40.04 39.85,40.04 40.05,40.24 v45.85,40.24
B6  (via drill 0.2)
  Top 0.127: v31.45,41.19 31.45,47.09 U3.61 | v49.05,39.69 48.7,40.04 47.65,40.04 U$1.P123
  Bottom 0.127: v31.45,41.19 31.45,40.44 31.2,40.19 31.2,39.44 39.65,39.44 40.15,39.94 45.05,39.94 45.55,39.44 48.8,39.44 v49.05,39.69
B7  (via drill 0.2)
  Top 0.127: U3.62 31.1,47.24 31.1,47.84 v31.6,48.34 | v49.55,46.94 49.65,46.84 49.65,39.54 49.25,39.14 48.7,39.14 48.7,39.29 48.45,39.54 47.65,39.54 U$1.P124
  Bottom 0.127: v31.6,48.34 32.9,47.04 49.45,47.04 v49.55,46.94
BAT
  Top 0.127: U3.6 27,31.59 27,22.39 BAT.1
BOOT0  (via drill 0.2)
  Top 0.127: R24.1 22.45,27.54 20.8,29.19 20.8,29.54 R30.2 20.85,29.59 20.85,30.99 20.8,31.04 20.8,35.69 v20.55,35.94 | v23.95,36.04 23.95,36.34 22.75,36.34 U3.94
  Bottom 0.127: v23.95,36.04 23.85,35.94 v20.55,35.94
CFG_CLK  (via drill 0.2)
  Top 0.127: v41,36.09 41,37.84 38.25,37.84 U3.35 | v50,36.04 50.9,35.14 v50.9,29.84 | v56.55,29.79 57.95,28.39 57.95,27.24 U$1.P17
  Bottom 0.127: v41,36.09 41.05,36.04 v50,36.04 | v50.9,29.84 50.95,29.79 v56.55,29.79
CFG_DATA  (via drill 0.2)
  Top 0.127: v20.5,38.34 21.3,39.14 21.7,39.14 21.95,38.89 22.7,38.89 U3.89 | v18.85,37.24 v18.85,38.34 | v17.45,36.34 16.7,35.59 v16.7,23.14 | v54.15,23.14 56.95,25.94 56.95,27.19 U$1.P15
  Bottom 0.127: v18.85,38.34 v20.5,38.34 | v18.85,37.24 17.95,36.34 v17.45,36.34 | v16.7,23.14 16.8,23.04 22.2,23.04 22.55,23.39 49.4,23.39 49.65,23.14 v54.15,23.14
CFG_RESET  (via drill 0.2)
  Top 0.127: v42.4,27.44 42.4,28.29 41.55,29.14 41.55,38.34 38.25,38.34 U3.36 | v56.9,28.69 57.45,28.14 57.45,27.24 U$1.P16
  Bottom 0.127: v42.4,27.44 42.5,27.54 55.75,27.54 v56.9,28.69
CS_LLS
  Top 0.127: R21.2 15.95,55.84 15.15,55.04 15.15,43.89 13.05,41.79 12.8,41.79 MICRO_SD1.2
CTRL_CLK  (via drill 0.2)
  Top 0.127: v21.5,38.59 21.5,38.39 22.7,38.39 U3.90 | v42.1,38.54 42.8,37.84 42.8,32.74 v43.75,31.79 | v52.2,31.54 52.4,31.34 52.4,27.29 52.45,27.24 U$1.P6
  Bottom 0.127: v21.5,38.59 21.55,38.54 v42.1,38.54 | v43.75,31.79 44,32.04 51.7,32.04 v52.2,31.54
D0  (via drill 0.2)
  Top 0.127: v57.95,19.04 60.9,21.99 60.9,27.14 60.95,27.19 U$1.P23 | v34.6,19.49 30.5,15.39 30.5,3.84 4A.1 | v36.45,63.89 36.45,62.49 36.75,62.19 U2.13 | v5.1,30.49 v5.1,59.34 | v15.2,22.49 15.4,22.29 15.4,21.94 17.55,19.79 v17.55,19.24
  Bottom 0.127: v57.95,19.04 44.15,19.04 43.7,19.49 v34.6,19.49 31.4,19.49 30,18.09 18.7,18.09 v17.55,19.24 | v36.45,63.89 35.9,64.44 11.2,64.44 10,63.24 9,63.24 v5.1,59.34 | v5.1,30.49 13.2,22.39 15.1,22.39 v15.2,22.49
D1  (via drill 0.2)
  Top 0.127: v62.6,19.94 62.6,27.09 62.5,27.19 U$1.P26 62.5,27.29 v62.5,45.89 | v34.6,18.19 33.05,16.64 33.05,3.84 5A.1 | v38.8,63.89 38.8,62.94 38.05,62.19 U2.14 | v55.85,62.99 58.75,60.09 v58.75,58.79 | v77.85,54.54 78.6,53.79 v78.6,46.84
  Bottom 0.127: v62.6,19.94 60.6,17.94 34.85,17.94 v34.6,18.19 | v38.8,63.89 39.35,64.44 54.4,64.44 v55.85,62.99 | v58.75,58.79 59.05,58.49 68.75,58.49 69,58.24 74.15,58.24 v77.85,54.54 | v78.6,46.84 78,46.24 62.85,46.24 v62.5,45.89
D2  (via drill 0.2)
  Top 0.127: v63.15,24.04 63.1,24.09 63.1,27.09 63,27.19 U$1.P27 | v44.1,21.69 35.6,13.19 35.6,3.84 6A.1 | v38.65,60.54 38.65,61.54 39.25,62.14 U2.15 | v5.65,57.79 5.9,57.54 v5.9,28.94
  Bottom 0.127: v63.15,24.04 62.4,23.29 55.05,23.29 53.45,21.69 v44.1,21.69 44.05,21.69 43.35,20.99 26.2,20.99 25.6,21.59 13.25,21.59 v5.9,28.94 | v38.65,60.54 38.2,60.99 8.85,60.99 v5.65,57.79
D3  (via drill 0.2)
  Top 0.127: v66.5,9.54 66.5,27.19 U$1.P34 66.55,27.24 66.55,29.94 66.4,30.09 66.4,32.19 66.55,32.34 66.55,46.44 v67.35,47.24 | v45.9,9.54 43.2,6.84 43.2,3.84 9A.1 | v43.3,75.19 40.6,75.19 U2.17 | v79.9,54.54 79.45,54.09 v79.45,51.54
  Bottom 0.127: v45.9,9.54 v66.5,9.54 | v43.3,75.19 45.1,73.39 75.55,73.39 82.45,66.49 82.45,54.54 v79.9,54.54 | v79.45,51.54 75.3,47.39 70.55,47.39 70.35,47.19 67.4,47.19 v67.35,47.24
D4  (via drill 0.2)
  Top 0.127: v68.65,27.04 68.65,30.54 69.8,30.54 U$1.P39 | v48.55,26.34 47.75,25.54 47.75,15.99 | 47.75,15.99 47.75,8.29 45.75,6.29 45.75,3.84 10A.1 | v39.3,68.09 U2.18 | v3.2,52.24 3.85,51.59 3.85,19.69 3.75,19.59 v3.75,18.84 | v47.7,15.99 47.75,15.99
  Bottom 0.127: v68.65,27.04 67.95,26.34 v48.55,26.34 | v39.3,68.09 37.6,66.39 19.3,66.39 18.8,65.89 11.25,65.89 11.1,66.04 5.85,66.04 1.2,61.39 1.2,52.24 v3.2,52.24 | v3.75,18.84 5.7,16.89 13.6,16.89 14.5,15.99 v47.7,15.99
D5  (via drill 0.2)
  Top 0.127: 62.03,18.27 61.75,17.99 61.75,17.24 61.4,16.89 v59.45,16.89 | 62.03,18.27 65.6,21.84 65.6,27.09 65.5,27.19 U$1.P32 | v44.1,15.44 40.65,11.99 40.65,3.84 8A.1 | v38.75,71.84 38.75,74.49 38.05,75.19 U2.19 | v70.2,71.39 74.3,67.29 74.3,64.19 74.95,63.54 74.95,61.29 76.9,59.34 76.9,43.09 76.75,42.94 76.75,12.89 v77.05,12.59 | v65.95,10.54 64.05,12.44 64.05,16.24 62.03,18.27
  Bottom 0.127: v59.45,16.89 58,15.44 v44.1,15.44 | v38.75,71.84 39.2,71.39 v70.2,71.39 | v77.05,12.59 75.1,10.64 66.05,10.64 v65.95,10.54
D6  (via drill 0.2)
  Top 0.127: v63.9,23.29 63.9,27.14 63.95,27.19 U$1.P29 64,27.29 64,45.29 v65.95,47.24 | v44.1,19.84 38.1,13.84 7A.1 | v40,66.64 37.55,69.09 37.55,74.44 36.8,75.19 U2.20 | v42.4,65.74 43.2,64.94 v43.2,63.89 | v67.45,61.29 67.2,61.04 67.2,54.59 67.1,54.49 v67.1,51.94 | v69.25,48.29 v69.25,51.54
  Bottom 0.127: v63.9,23.29 61.7,21.09 45.35,21.09 v44.1,19.84 | v40,66.64 40.9,65.74 v42.4,65.74 | v43.2,63.89 44.65,62.44 64.35,62.44 65.5,61.29 v67.45,61.29 | v67.1,51.94 67.5,51.54 v69.25,51.54 | v69.25,48.29 67,48.29 v65.95,47.24
D7  (via drill 0.2)
  Top 0.127: v49.95,14.89 60,24.94 60,27.19 U$1.P21 | 24.52,7.92 22.9,6.29 22.9,3.84 1A.1 | 24.52,7.92 v25,8.39 | v33.5,73.49 33.5,73.04 35.05,73.04 35.4,73.39 35.4,75.14 35.45,75.19 U2.21 | v17.5,70.44 17.75,70.19 17.75,61.44 18.45,60.74 18.45,57.79 v17.7,57.04 | v11.35,52.24 10.85,51.74 10.85,42.24 10.4,41.79 10.4,35.89 10.55,35.74 10.55,33.54 v10.5,33.49 | v13.25,30.74 14.15,29.84 14.15,22.79 16.6,20.34 16.6,15.84 24.52,7.92
  Bottom 0.127: v49.95,14.89 49.7,14.64 31.25,14.64 v25,8.39 | v33.5,73.49 32.95,74.04 21.1,74.04 v17.5,70.44 | v17.7,57.04 17.7,56.69 15.15,54.14 15.15,52.24 v11.35,52.24 | v13.25,30.74 v10.5,33.49
DI_LLS  (via drill 0.2)
  Top 0.127: v4.55,55.59 4.55,58.59 3.4,59.74 R17.2 | v14.6,53.34 14.6,43.74 13.75,42.89 12.8,42.89 MICRO_SD1.3
  Bottom 0.127: v4.55,55.59 12.35,55.59 v14.6,53.34
DOWN
  Top 0.127: U$1.P79 64.45,49.44 64.45,64.89 64.9,65.34 65.85,65.34 65.85,65.49 66.85,66.49 67.3,66.49 J2.2
EN_M1_NOT  (via drill 0.2)
  Top 0.127: v36.8,28.94 36.8,31.29 36.5,31.59 U3.25 | v48.05,28.74 48.7,29.39 48.7,31.29 48.45,31.54 47.65,31.54 U$1.P140
  Bottom 0.127: v36.8,28.94 47.85,28.94 v48.05,28.74
FIRE
  Top 0.127: U$1.P82 63.1,49.54 63.1,51.64 63.25,51.79 63.25,64.44 62.9,64.79 62.9,65.99 63.4,66.49 63.4,67.04 64.55,68.19 68.7,68.19 68.7,69.34 J2.6
FLASH_CS  (via drill 0.2)
  Top 0.127: v70.75,27.99 71,28.24 71,30.04 69.85,30.04 U$1.P38 | v74.15,28.24 74.55,28.64 74.55,38.29 73.6,39.24 v73.6,49.39 | v70.75,50.99 69.75,51.99 69.75,64.64 69.1,65.29 v66.4,65.29 | v55.3,64.39 53.8,62.89 U4.1
  Bottom 0.127: v70.75,27.99 71,28.24 v74.15,28.24 | v73.6,49.39 72,50.99 v70.75,50.99 | v66.4,65.29 66.35,65.24 64.45,65.24 63.6,64.39 v55.3,64.39
FLASH_MISO  (via drill 0.2)
  Top 0.127: v68.4,44.69 68.4,43.59 69.8,43.59 U$1.P65 | v71.8,44.84 71.8,46.44 71.6,46.64 71.6,52.89 71.85,53.14 71.85,56.94 v72.05,57.14 | v62.7,57.39 62.25,57.84 v62.25,60.99 | v52.1,60.99 53.75,60.99 53.75,61.59 U4.2
  Bottom 0.127: v68.4,44.69 68.55,44.84 v71.8,44.84 | v72.05,57.14 62.95,57.14 v62.7,57.39 | v52.1,60.99 v62.25,60.99
FLASH_MOSI  (via drill 0.2)
  Top 0.127: v67.85,45.24 67.85,43.09 69.8,43.09 U$1.P64 | v71.25,45.39 71.3,45.44 71.3,52.99 71.4,53.09 v71.4,57.69 | v61.4,57.94 60.55,58.79 60.55,59.04 U4.5
  Bottom 0.127: v67.85,45.24 68,45.39 v71.25,45.39 | v71.4,57.69 71.15,57.94 v61.4,57.94
FLASH_SCLK  (via drill 0.2)
  Top 0.127: v70.3,47.89 70.9,47.29 70.9,46.09 U$1.P70 | v67.95,47.74 68.2,47.99 68.2,52.99 67.65,53.54 v67.65,54.29 | v62.7,55.89 61.95,56.64 61.95,59.34 61,60.29 60.55,60.29 U4.6
  Bottom 0.127: v70.3,47.89 70.15,47.74 v67.95,47.74 | v67.65,54.29 66.05,55.89 v62.7,55.89
GET_CTRL_REG  (via drill 0.2)
  Top 0.127: v29.05,44.29 29,44.34 29,47.09 U3.66 | v15.05,42.49 15.05,37.84 15.4,37.49 v15.4,27.34 | v52.15,24.59 52.25,24.69 52.25,26.19 52,26.44 52,27.19 U$1.P5
  Bottom 0.127: v29.05,44.29 28.15,43.39 24.3,43.39 24.15,43.54 16.1,43.54 v15.05,42.49 | v15.4,27.34 17.35,25.39 48.05,25.39 48.85,24.59 v52.15,24.59
GET_DATA_REG  (via drill 0.2)
  Top 0.127: v24.8,24.84 24.8,28.64 23.15,30.29 23.15,32.29 23.25,32.39 23.25,32.64 24.15,32.64 25.9,34.39 25.9,40.44 25.65,40.69 25.65,42.24 24.55,43.34 24.55,44.34 22.75,44.34 U3.78 | v49.85,23.69 50.45,24.29 50.45,27.19 U$1.P2
  Bottom 0.127: v24.8,24.84 25.95,23.69 v49.85,23.69
GND  (via drill 0.2)  (2 unrouted)
  Top 0.3: 71.45,38.09 71.9,37.64 71.9,35.59 U$1.P49 | 71.45,38.09 U$1.P54 | C33.2 73.1,14.59 75.4,14.59 75.4,14.89 IC5.1 75.45,15.04 76.35,15.94 76.35,40.14 v76.2,40.29 76.35,40.34 76.35,52.49 | 71.45,38.09 72.15,38.79 v72.15,40.29 | 76.35,52.49 v76.35,58.74 | U4.4 53.8,59.09 54.4,59.09 55.2,59.89 55.2,63.24 55.95,63.99 55.95,64.14 56.7,64.14 C24.2 56.8,64.29 v56.8,66.09 | JP8.2 45.7,69.84 43.85,67.99 43.85,56.69 43.2,56.04 C10.2 43.25,55.89 44.85,54.29 v44.85,52.14 | v40.75,68.14 40.75,62.34 40.6,62.19 U2.16 | U$1.P113 48.6,45.09 48.6,45.14 48.9,45.44 48.9,48.19 49.95,49.24 49.95,49.39 U$1.P108 50,49.59 v50,50.89 | 58.5,50.89 U$1.P91 | 58.5,50.89 58.5,53.34 C25.2 60.25,53.29 v61.35,52.19 | v56,50.89 U$1.P96 | v58.45,50.89 58.5,50.89 | 68.6,52.49 68.6,45.44 68.95,45.09 69.8,45.09 U$1.P68 | 68.6,52.49 68.6,53.44 68.85,53.69 C4.1 | v67.65,52.49 67.75,52.39 67.75,49.69 U$1.P73 | v68.75,52.49 68.6,52.49 | U$1.P25 61.95,27.24 61.95,31.04 59.6,33.39 59.6,44.64 63.25,48.29 65.45,48.29 65.45,49.39 U$1.P77 65.5,49.59 65.5,51.24 v65.9,51.64 | v49.85,70.84 61.7,70.84 63.15,69.39 J2.8 | v76.2,52.49 76.35,52.49 | 49.4,33.44 49.25,33.59 U$1.P136 | 49.4,33.44 50.3,33.44 50.3,34.84 48.55,36.59 U$1.P130 | 50.5,22.14 50.95,22.59 50.95,27.19 U$1.P3 | 50.5,22.14 C26.2 50.05,21.49 50.05,20.74 52.3,20.74 52.55,20.99 52.55,22.44 55.95,25.84 55.95,27.19 U$1.P13 | 49.2,24.24 49.2,23.44 50.5,22.14 | 49.2,24.24 49.2,33.24 49.4,33.44 | U3.99 22.7,33.84 22,33.84 21.8,33.64 21.8,30.24 22.45,29.59 R30.1 22.5,29.44 23.3,28.64 23.3,26.84 22.9,26.44 | C11.1 19.5,16.54 19.5,19.04 C12.1 19.5,19.19 19.5,21.04
  Top 0.3: 19.5,21.04 19.5,22.04 R25.1 20.8,23.44 21.55,24.19 21.55,26.29 22.75,26.29 22.9,26.44 | v34.35,32.84 34,32.49 34,31.64 U3.20 | U3.27 38.2,33.84 37.5,33.84 v36.5,32.84 37.45,31.89 v37.45,26.74 | 30.1,24.24 30.1,21.44 C5.1 30,21.29 29,20.29 v29,5.49 | 30.1,24.24 30.1,25.39 C23.1 30.2,25.49 30.4,25.69 30.4,28.69 30.05,28.69 29,29.74 29,31.59 U3.10 | v33.35,24.24 33.35,25.14 33.55,25.34 C22.1 33.65,25.49 33.65,25.69 v34.6,26.64 | v30.2,24.24 30.1,24.24 | v40.75,26.89 40.75,27.64 41.2,28.09 C18.2 | 22.9,26.44 24.15,25.19 24.15,24.59 24.55,24.19 25.65,24.19 v25.65,24.74 | v48.3,24.24 49.2,24.24 | IC2.1 8.35,25.94 6.25,23.84 6.25,22.69 J3.SH1 | J3.SH3 2.05,22.69 3.4,24.04 3.4,33.99 2.35,35.04 MICRO_SD1.MP3 2.35,35.19 3.3,36.14 v3.3,36.64 | 18.52,72.22 18.45,72.29 18.45,75.59 18.2,75.84 8.35,75.84 8.35,75.74 LED3.P3 8.35,75.59 8.35,74.74 LED3.P2 8.35,74.59 8.35,73.54 LED3.P1 8.5,73.49 8.5,68.54 8.8,68.24 C1.2 8.9,68.09 8.9,66.04 C3.2 8.8,65.89 8.3,65.39 8.3,58.99 10.05,57.24 JP4.2 10.2,57.14 12,55.34 12,50.99 MICRO_SD1.MP1 12,50.84 11.8,50.64 11.8,46.19 | 18.52,72.22 19.75,70.99 C19.2 | v18.6,72.29 18.52,72.22 | v28.65,52.64 29.3,53.29 29.3,55.84 C7.2 | U3.74 25,47.14 25,48.24 25.05,48.29 v25.05,50.24 24.05,51.24 v24.05,57.04 | v15.7,37.94 17.15,37.94 C2.2 | MICRO_SD1.MP4 12.05,35.84 12.05,36.84 v12.6,37.39 11.8,38.19 11.8,46.19 | 11.8,46.19 12.75,46.19 MICRO_SD1.6 | 4.05,66.04 4.1,66.04 4.1,66.44 4.65,66.99 IC10.6 | 4.05,66.04 IC10.2 | v2.55,55.99 2.55,51.09 2.35,50.89 MICRO_SD1.MP2 | v4.05,60.94 4.05,66.04 | v19.4,21.04 19.5,21.04
  Bottom 0.3: JP2.2 81.8,42.14 80.4,40.74 76.65,40.74 v76.2,40.29 76.1,40.19 72.25,40.19 v72.15,40.29 | v76.35,58.74 81.2,58.74 81.45,58.49 S1.1 | v56.8,66.09 58.5,67.79 61.6,67.79 63.15,69.34 J2.8 | v58.45,50.89 58.35,50.79 56.1,50.79 v56,50.89 v50,50.89 49.9,50.99 49.7,50.99 49.3,51.39 45.6,51.39 v44.85,52.14 | v65.9,51.64 66.8,52.54 | 66.8,52.54 66.85,52.59 67.55,52.59 v67.65,52.49 v68.75,52.49 v76.2,52.49 | v61.35,52.19 61.8,52.64 66.7,52.64 66.8,52.54 | v49.85,70.84 48.9,69.89 45.85,69.89 JP8.2 45.7,69.84 42.45,69.84 v40.75,68.14 39.1,69.79 17.2,69.79 15.4,71.59 JP1.1 14.7,71.09 15.9,72.29 v18.6,72.29 | 5B.1 33,3.84 30.5,3.84 4B.1 30.5,3.99 v29,5.49 | v36.5,32.84 v34.35,32.84 | v40.75,26.89 40.5,26.64 37.45,26.64 | v34.6,26.64 37.45,26.64 | v37.45,26.74 37.45,26.64 | v25.65,24.74 26.2,24.19 30.1,24.19 v30.2,24.24 v33.35,24.24 33.45,24.19 48.25,24.19 v48.3,24.24 | J3.SH2 6.2,13.99 6.15,13.94 2.1,13.94 J3.SH4 2.05,14.14 J3.SH3 2.15,22.74 6.15,22.74 6.2,22.69 J3.SH1 6.35,22.59 6.5,22.59 7.9,21.19 19.25,21.19 v19.4,21.04 | v25.05,50.24 27.45,52.64 v28.65,52.64 | v15.7,37.94 15.15,37.39 v12.6,37.39 12.5,37.29 3.95,37.29 v3.3,36.64 | v2.55,55.99 3.7,57.14 4.05,57.14 | 4.05,57.14 JP4.2 10.3,57.19 10.8,57.69 17.95,57.69 18.45,57.19 23.9,57.19 v24.05,57.04 | 4.05,57.14 v4.05,60.94
LE_IL  (via drill 0.2)
  Top 0.127: v27.55,27.29 27.5,27.34 27.5,31.59 U3.7 | v56.1,28.69 56.45,28.34 56.45,27.24 U$1.P14
  Bottom 0.127: v27.55,27.29 27.7,27.44 41.65,27.44 42.2,27.99 44.85,27.99 45,27.84 55.25,27.84 v56.1,28.69
LEDB  (via drill 0.2)
  Top 0.127: v16.3,42.99 16.3,48.14 16.75,48.59 16.75,60.94 13.7,60.94 9.75,64.89 9.75,71.29 9.4,71.64 R3.1 | v23.95,42.99 23.55,43.39 23.55,43.64 23.35,43.84 22.75,43.84 U3.79
  Bottom 0.127: v16.3,42.99 16.4,43.09 23.85,43.09 v23.95,42.99
LEDG  (via drill 0.2)
  Top 0.127: v7.05,52.74 7.05,67.24 6.9,67.39 6.9,71.09 6.35,71.64 R13.1 | v4.4,50.09 4.3,49.99 v4.3,19.39 | v32.75,20.44 32.8,20.49 32.8,30.69 32.5,30.99 32.5,31.59 U3.17
  Bottom 0.127: v4.4,50.09 v7.05,52.74 | v4.3,19.39 4.7,19.79 25.85,19.79 26.5,20.44 v32.75,20.44
LEDR  (via drill 0.2)
  Top 0.127: v2.5,70.29 2.5,70.79 R2.1 | v18.6,66.44 20.7,64.34 20.7,49.89 21.5,49.09 21.5,43.99 22.1,43.39 22.7,43.39 U3.80
  Bottom 0.127: v2.5,70.29 6.35,66.44 v18.6,66.44
LEFT
  Top 0.127: U$1.P80 64.1,49.54 64.1,66.04 64.55,66.49 J2.3
MEM_ACCESS  (via drill 0.2)
  Top 0.127: v32.1,30.39 32.1,31.49 32,31.59 U3.16 | v55,30.39 U$1.P11
  Bottom 0.127: v32.1,30.39 32.65,30.94 39.25,30.94 40.05,30.14 45.75,30.14 46,30.39 v55,30.39
MISO  (via drill 0.2)
  Top 0.127: v12.65,54.29 12.65,56.79 15.95,60.09 R20.1 | v14.45,34.69 v14.45,36.09 | v36.2,34.64 36.45,34.89 36.45,35.09 37.2,35.84 38.2,35.84 U3.31
  Bottom 0.127: v12.65,54.29 4.05,45.69 4.05,37.69 3.6,37.69 2.75,36.84 2.75,36.09 v14.45,36.09 | v14.45,34.69 14.7,34.94 18.45,34.94 18.65,35.14 20.2,35.14 20.25,35.09 23.7,35.09 23.75,35.14 27.25,35.14 27.75,34.64 v36.2,34.64
MOSI  (via drill 0.2)
  Top 0.127: v1.95,60.94 1.95,60.04 1.7,59.79 R17.1 | v32.65,32.89 v29.85,35.69 | v39.35,32.64 39.35,35.84 38.85,36.34 38.25,36.34 U3.32
  Bottom 0.127: v1.95,60.94 1.95,60.29 1.5,59.84 1.5,52.79 3.4,52.79 3.75,52.44 3.75,38.24 3,38.24 2.45,37.69 2.45,34.99 14,34.99 14.25,35.24 18.35,35.24 18.55,35.44 20.3,35.44 20.35,35.39 23.6,35.39 23.7,35.49 27.5,35.49 27.75,35.74 29.8,35.74 v29.85,35.69 | v32.65,32.89 33.55,31.99 38.7,31.99 v39.35,32.64
N$1  (via drill 0.2)
  Top 0.127: v71.6,25.89 71.6,34.04 69.85,34.04 U$1.P46 | v60.1,21.94 53.35,15.19 53.35,12.24 SJ2.1
  Bottom 0.127: v71.6,25.89 71.6,24.39 64.25,24.39 62.85,22.99 61.15,22.99 v60.1,21.94
N$2  (via drill 0.2)
  Top 0.127: v17.3,58.94 17.3,59.74 17.65,60.09 R20.2 | v16.2,58.34 13.65,55.79 13.65,47.89 13.05,47.29 12.8,47.29 MICRO_SD1.7
  Bottom 0.127: v17.3,58.94 16.7,58.34 v16.2,58.34
N$4
  Top 0.127: R22.1 9.3,15.54 9.3,17.74 R23.1 9.25,17.59 J3.B6 6.75,17.59 6.25,17.59 6,17.84 6,18.54 6.75,18.54 J3.A6
N$10  (via drill 0.2)
  Top 0.127: v79.45,28.59 80.4,29.54 R12.2 | v70.45,28.79 69.85,29.39 69.85,29.54 U$1.P37
  Bottom 0.127: v79.45,28.59 79.25,28.79 v70.45,28.79
N$11
  Top 0.127: U3.73 25.6,47.24 25.6,54.94 C7.1
N$12
  Top 0.127: 8.33,19.02 7.4,18.09 J3.A7 | 8.33,19.02 9.25,19.94 R26.1 | J3.B7 6.8,19.04 8.3,19.04 8.33,19.02
N$15
  Top 0.127: LED2.A 11.95,74.69 13.7,74.69 R11.2
N$16  (via drill 0.2)
  Top 0.127: v38.55,50.84 38.55,48.09 39.05,47.59 39.05,44.89 38.25,44.89 U3.49 | v42.4,51.79 43.15,52.54 43.15,53.19 C10.1
  Bottom 0.127: v38.55,50.84 39.5,51.79 v42.4,51.79
N$18  (via drill 0.2)
  Top 0.127: v16.3,15.34 16.3,15.89 15.7,16.49 R14.1 | C11.2 v20.05,15.39 | U3.12 29.9,31.54 v29.9,29.74 | v28.1,28.29 28.1,26.54 27.55,25.99 27.55,22.59 27.7,22.44 27.7,21.64 25.15,19.09 25.15,17.79 Q3.1 24.25,16.39 v23.3,15.44
  Bottom 0.127: v16.3,15.34 16.35,15.39 v20.05,15.39 20.1,15.39 20.15,15.44 v23.3,15.44 | v29.9,29.74 28.45,28.29 v28.1,28.29
N$19  (via drill 0.2)
  Top 0.127: 21.95,18.29 21.95,14.84 19.05,14.84 17.4,16.49 R14.2 17.4,16.54 17.4,18.34 18.85,19.79 18.85,24.29 19.1,24.54 19.1,32.34 v19.4,32.64 | 21.95,18.29 21.2,19.04 C12.2 | v30.4,32.84 30.4,31.69 30.45,31.64 U3.13 | v26.65,19.84 26.65,18.79 Q3.3 | v22.35,18.64 22,18.29 21.95,18.29
  Bottom 0.127: v30.4,32.84 29.85,33.39 28.4,33.39 28.15,33.14 19.9,33.14 v19.4,32.64 | v26.65,19.84 25.45,18.64 v22.35,18.64
N$20  (via drill 0.2)
  Top 0.127: v19.45,24.14 20.7,25.39 R16.1